# EasyEDA schematic SCH_motor-driver_2025-12-12.json
TITLE: Driver proof of concept; REV: 1.0; Date: 2025-12-11; Sheet: 1/1; Drawn By: Ruben Van Landuyt; Company: Your Company
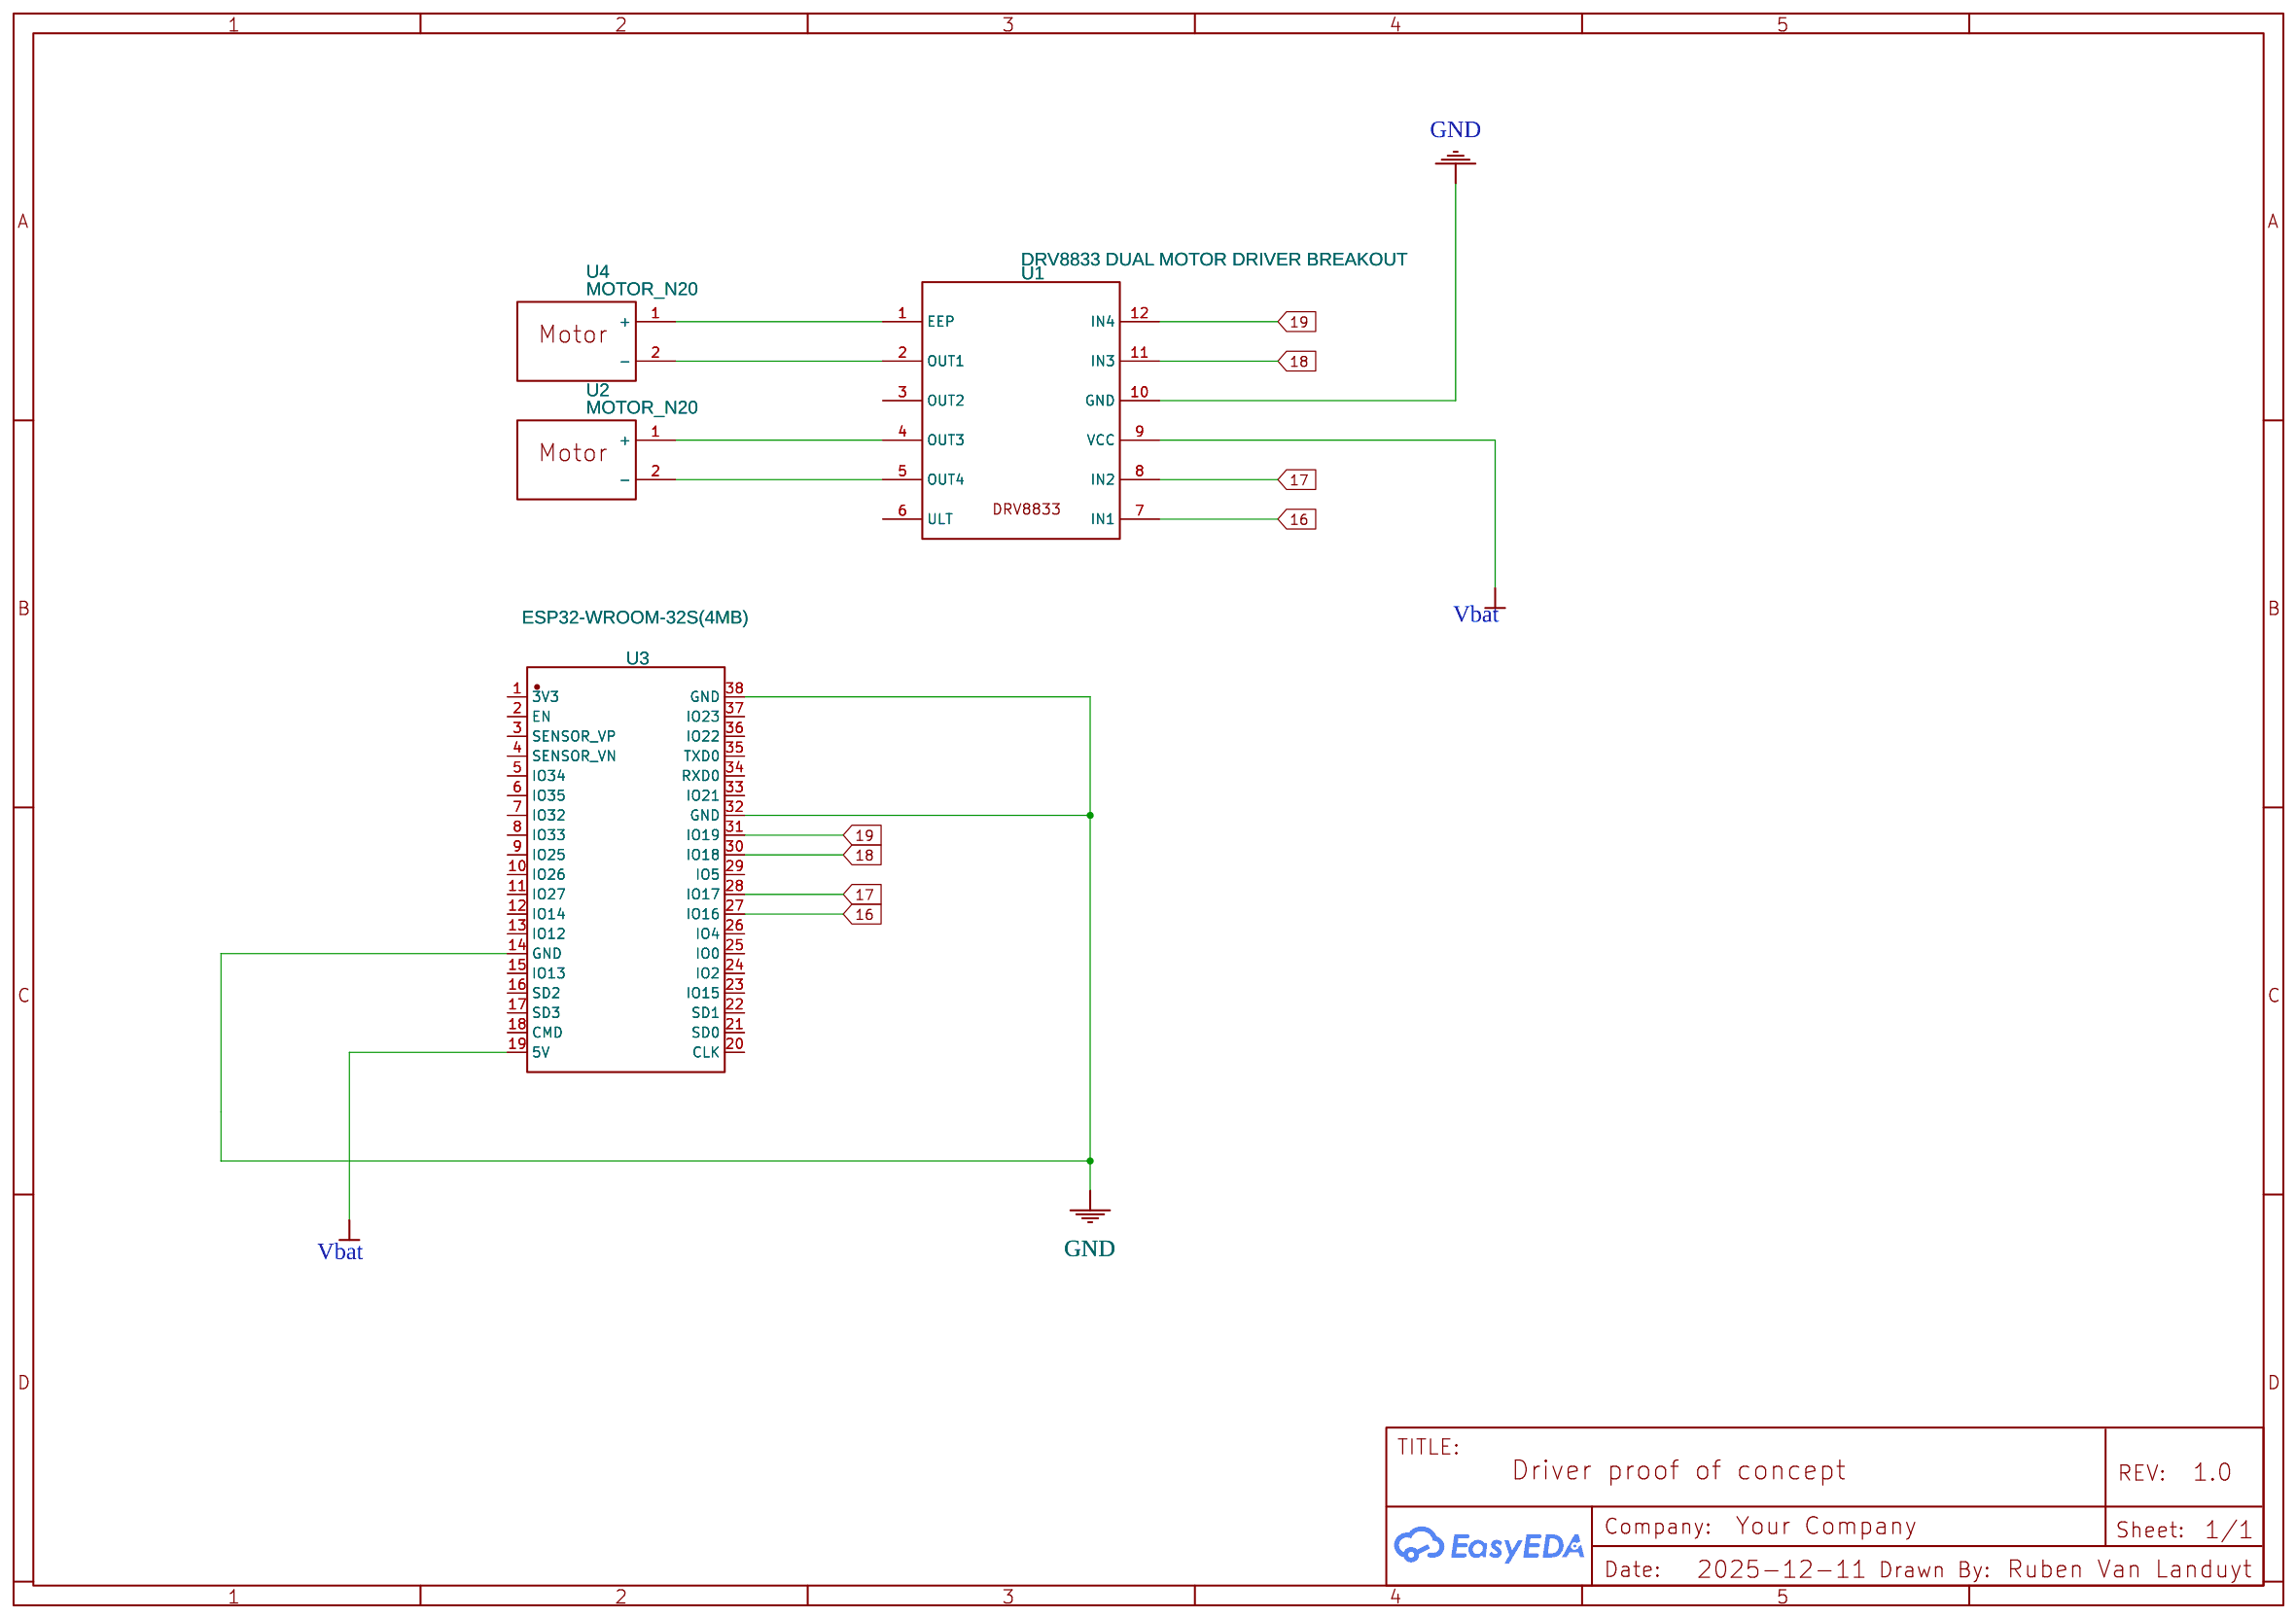
[diagram p0: schematic sheet]

## Parts
U1  DRV8833 DUAL MOTOR DRIVER BREAKOUT  [DRV8833 DUAL MOTOR DRIVER M]
U2  MOTOR_N20  [MOTOR N20]
U3  ESP32-WROOM-32S(4MB)  [WIFIM-SMD_39P-L19.2-W18.0-P1.27]
U4  MOTOR_N20  [MOTOR N20]

## Library data of the parts
U1 = DRV8833 DUAL MOTOR DRIVER BREAKOUT: Contributor: ayush2002; sourceId: YsmgyP7pj
U2 U4 = MOTOR_N20: Contributor: alexun9999
U3 = ESP32-WROOM-32S(4MB): Supplier: LCSC; Supplier Part: C529580; Manufacturer: Espressif Systems; Contributor: Aaron Hentschel; JLCPCB Part Class: Extended Part

## Nets
GND: U1.10(GND) U3.14(GND) U3.32(GND) U3.38(GND)
Vbat: U1.9(VCC) U3.19(5V)
16: U1.7(IN1) U3.27(IO16)
17: U1.8(IN2) U3.28(IO17)
18: U1.11(IN3) U3.30(IO18)
19: U1.12(IN4) U3.31(IO19)
Net-(U1-1): U1.1(EEP) U4.1(+)
Net-(U1-2): U1.2(OUT1) U4.2(-)
Net-(U1-4): U1.4(OUT3) U2.1(+)
Net-(U1-5): U1.5(OUT4) U2.2(-)

Not connected (* = marked no-connect by the designer): U1 3(OUT2) 6(ULT); U3 1(3V3) 2(EN) 3(SENSOR_VP) 4(SENSOR_VN) 5(IO34) 6(IO35) 7(IO32) 8(IO33) 9(IO25) 10(IO26) 11(IO27) 12(IO14) 13(IO12) 15(IO13) 16(SD2) 17(SD3) 18(CMD) 20(CLK) 21(SD0) 22(SD1) 23(IO15) 24(IO2) 25(IO0) 26(IO4) 29(IO5) 33(IO21) 34(RXD0) 35(TXD0) 36(IO22) 37(IO23)
